# EAGLE design Module_MCU_ArduinoNano (EAGLE 9.6.2)
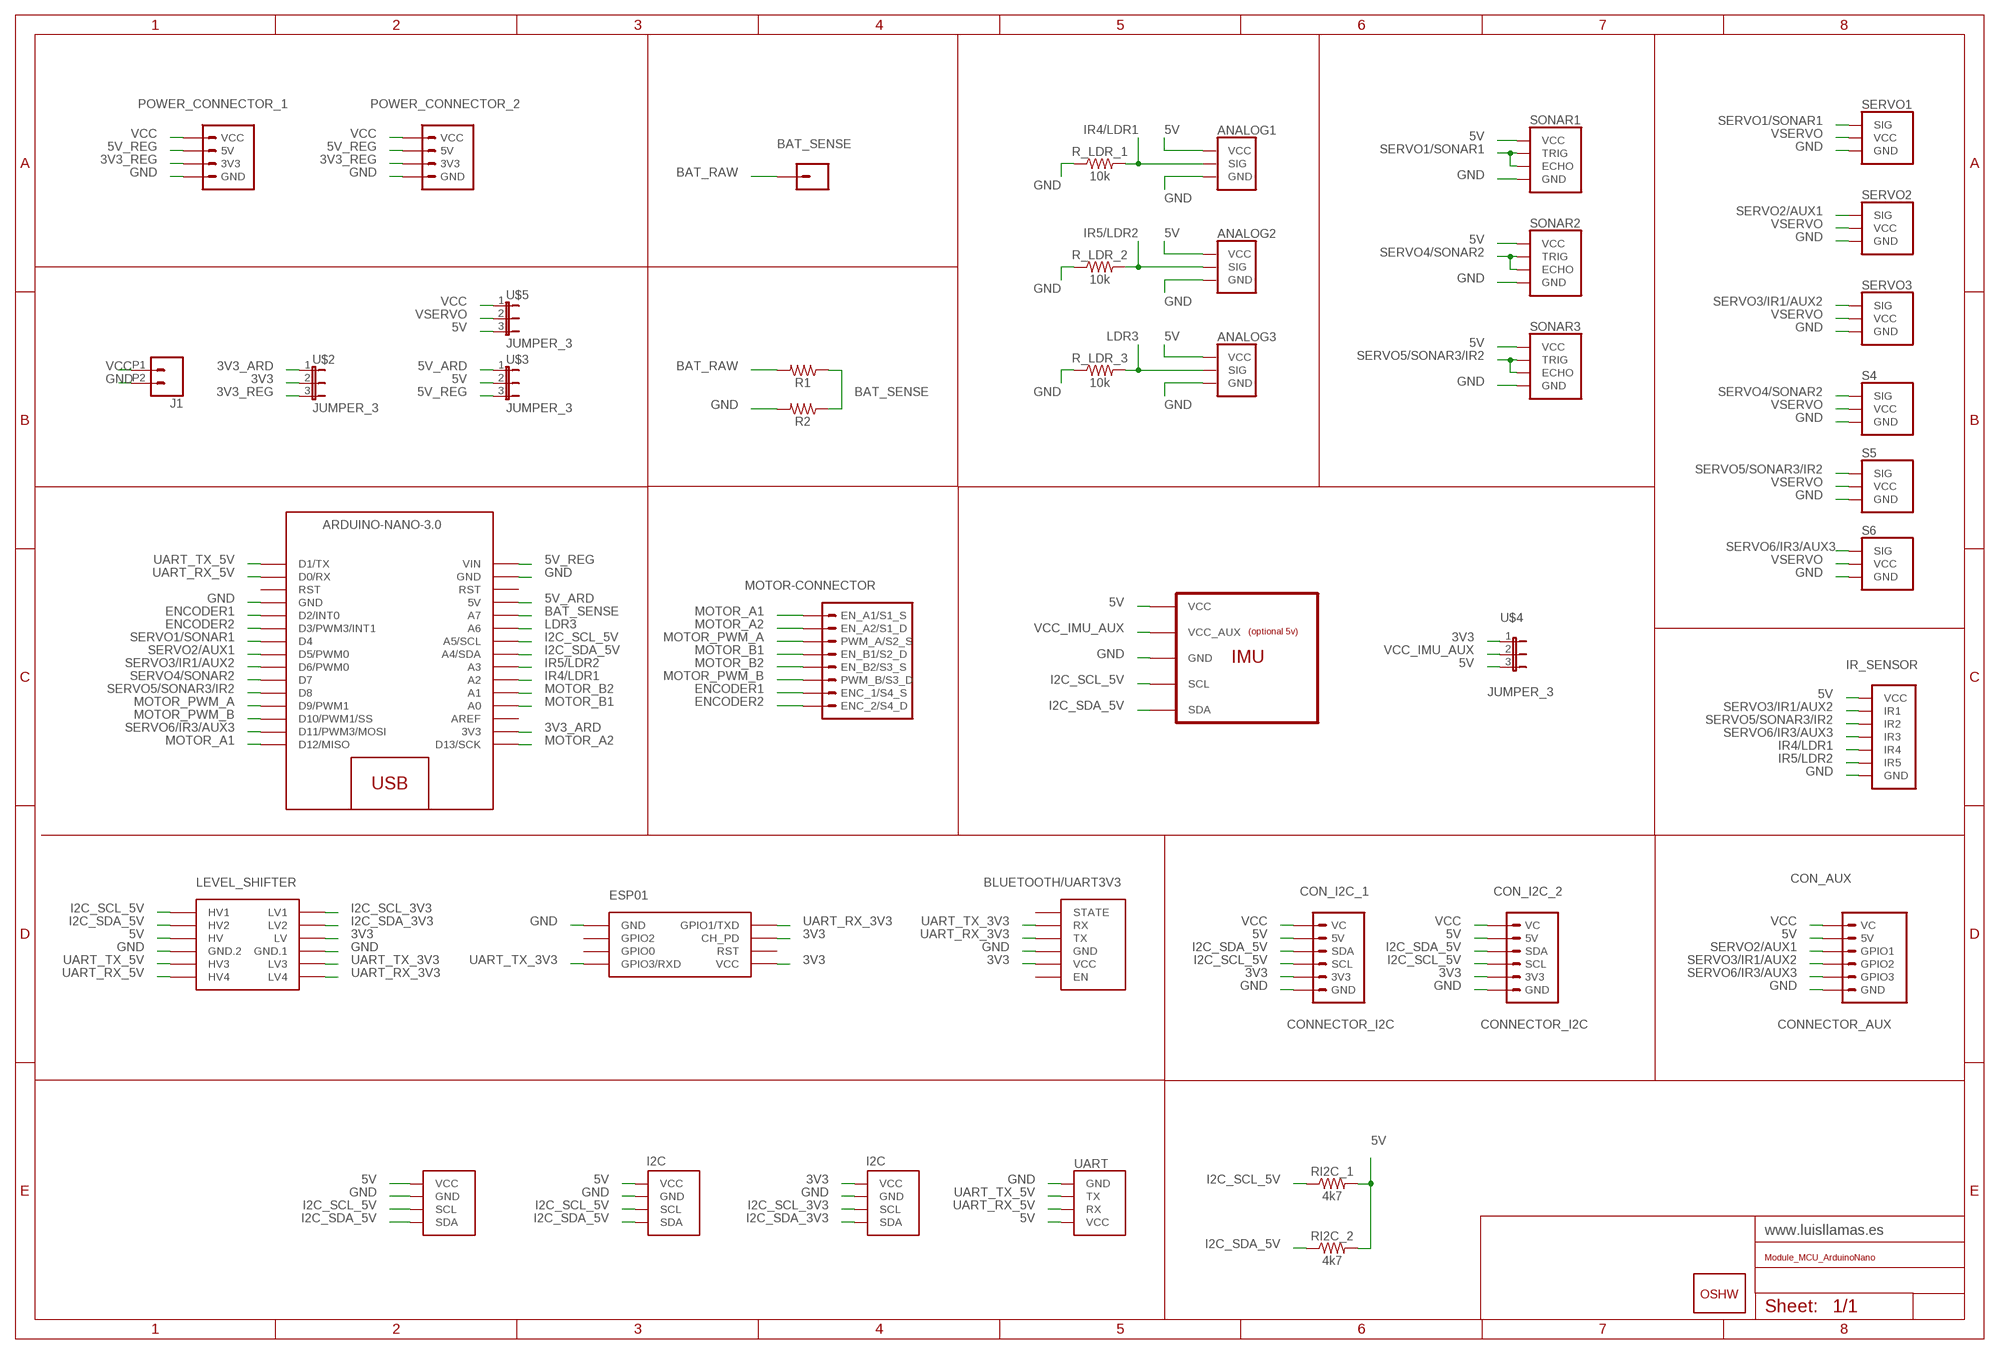
[diagram p0: schematic, sheet 1]

## Parts
ANALOG1  LDR/OCT  [LDR]
ANALOG2  LDR/OCT  [LDR]
ANALOG3  LDR/OCT  [LDR]
ARDUINO_NANO1  ARDUINO-NANO-3.0  [ARDUINO-NANO-3.0]
BAT_SENSE  CONN_01  [1X01]
BLUETOOTH/UART3V3  BLUETOOTH-HC-05  [BLUETOOTH-HC-05]
CON_AUX  CONNECTOR_AUX  [CONNECTOR_AUX]
CON_I2C_1  CONNECTOR_I2C  [CONNECTOR_I2C]
CON_I2C_2  CONNECTOR_I2C  [CONNECTOR_I2C]
GOLD_ORB_SM1  OSHWLOGO_GOLD_ORB_MED  [OSHW1]
I2C_1  I2C  GENERIC_I2CVCC_GND_SCL_SDA  [I2C_VCC_GND_SCL_SDA]
I2C_2  GENERIC_I2CVCC_GND_SCL_SDA  [I2C_VCC_GND_SCL_SDA]
I2C_3  I2C  GENERIC_I2CVCC_GND_SCL_SDA  [I2C_VCC_GND_SCL_SDA]
IR_SENSOR  IR-5/OCT  [IR-5]
J1  CONN_022.54MM_SCREWTERM  [1X02_2.54_SCREWTERM]
LEVEL_SHIFTER  LEVEL-SHIFTER-4CH  [LEVEL-SHIFTER-4CH]
MOTOR_CONNECTOR  MOTOR-CONNECTOR  [MOTOR-CONNECTOR]
POWER_CONNECTOR_1  POWER-CONNECTOR  [POWER-CONNECTOR]
POWER_CONNECTOR_2  POWER-CONNECTOR  [POWER-CONNECTOR]
R1  RESISTOR1206  [1206]
R2  RESISTOR1206  [1206]
R_LDR_1  10k  RESISTOR1206  [1206]
R_LDR_2  10k  RESISTOR1206  [1206]
R_LDR_3  10k  RESISTOR1206  [1206]
RI2C_1  4k7  RESISTOR1206  [1206]
RI2C_2  4k7  RESISTOR1206  [1206]
S4  SERVOSERVO  [SERVO]
S5  SERVOSERVO  [SERVO]
S6  SERVOSERVO  [SERVO]
SERVO1  SERVOSERVO  [SERVO]
SERVO2  SERVOSERVO  [SERVO]
SERVO3  SERVOSERVO  [SERVO]
SONAR1  ULTRASONIC/OCT  [ULTRASONIC]
SONAR2  ULTRASONIC/OCT  [ULTRASONIC]
SONAR3  ULTRASONIC/OCT  [ULTRASONIC]
U1  IMU_6/9/10DOFMPU6050  [IMU_6/9/10DOF]
U$1  ESP01  [ESP01]
U$2  JUMPER_3  [JUMPER_3]
U$3  JUMPER_3  [JUMPER_3]
U$4  JUMPER_3  [JUMPER_3]
U$5  JUMPER_3  [JUMPER_3]
UART  UART  GENERIC_UARTGND_TX_RX_VCC  [GENERIC_UART]

## Nets
3V3: BLUETOOTH/UART3V3.VCC CON_I2C_1.3V3 CON_I2C_2.3V3 I2C_3.VCC LEVEL_SHIFTER.J1.3(LV) U$1.CH_PD U$1.VCC U$2.2 U$4.1
3V3_ARD: ARDUINO_NANO1.3V3 U$2.1
3V3_REG: POWER_CONNECTOR_1.3V3 POWER_CONNECTOR_2.3V3 U$2.3
5V: ANALOG1.VCC ANALOG2.VCC ANALOG3.VCC CON_AUX.5V CON_I2C_1.5V CON_I2C_2.5V I2C_1.VCC I2C_2.VCC IR_SENSOR.VCC LEVEL_SHIFTER.J2.3(HV) RI2C_1.2 RI2C_2.2 SONAR1.VCC SONAR2.VCC SONAR3.VCC U1.VCC U$3.2 U$4.3 U$5.3 UART.VCC
5V_ARD: ARDUINO_NANO1.5V U$3.1
5V_REG: ARDUINO_NANO1.VIN POWER_CONNECTOR_1.5V POWER_CONNECTOR_2.5V U$3.3
BAT_RAW: BAT_SENSE.1 R1.2
BAT_SENSE: ARDUINO_NANO1.A7 R1.1 R2.1
ENCODER1: ARDUINO_NANO1.D2(D2/INT0) MOTOR_CONNECTOR.ENC_1/S4_S
ENCODER2: ARDUINO_NANO1.D3(D3/PWM3/INT1) MOTOR_CONNECTOR.ENC_2/S4_D
GND: ANALOG1.GND ANALOG2.GND ANALOG3.GND ARDUINO_NANO1.GND@1(GND) ARDUINO_NANO1.GND@2(GND) BLUETOOTH/UART3V3.GND CON_AUX.GND CON_I2C_1.GND CON_I2C_2.GND I2C_1.GND I2C_2.GND I2C_3.GND IR_SENSOR.GND J1.P2 LEVEL_SHIFTER.J1.4(GND.1) LEVEL_SHIFTER.J2.4(GND.2) POWER_CONNECTOR_1.GND POWER_CONNECTOR_2.GND R2.2 R_LDR_1.1 R_LDR_2.1 R_LDR_3.1 S4.GND S5.GND S6.GND SERVO1.GND SERVO2.GND SERVO3.GND SONAR1.GND SONAR2.GND SONAR3.GND U1.GND U$1.GND UART.GND
I2C_SCL_3V3: I2C_3.SCL LEVEL_SHIFTER.J1.1(LV1)
I2C_SCL_5V: ARDUINO_NANO1.A5(A5/SCL) CON_I2C_1.SCL CON_I2C_2.SCL I2C_1.SCL I2C_2.SCL LEVEL_SHIFTER.J2.1(HV1) RI2C_1.1 U1.SCL
I2C_SDA_3V3: I2C_3.SDA LEVEL_SHIFTER.J1.2(LV2)
I2C_SDA_5V: ARDUINO_NANO1.A4(A4/SDA) CON_I2C_1.SDA CON_I2C_2.SDA I2C_1.SDA I2C_2.SDA LEVEL_SHIFTER.J2.2(HV2) RI2C_2.1 U1.SDA
IR4/LDR1: ANALOG1.SIG ARDUINO_NANO1.A2 IR_SENSOR.4(IR4) R_LDR_1.2
IR5/LDR2: ANALOG2.SIG ARDUINO_NANO1.A3 IR_SENSOR.5(IR5) R_LDR_2.2
LDR3: ANALOG3.SIG ARDUINO_NANO1.A6 R_LDR_3.2
MOTOR_A1: ARDUINO_NANO1.D12(D12/MISO) MOTOR_CONNECTOR.EN_A1/S1_S
MOTOR_A2: ARDUINO_NANO1.D13(D13/SCK) MOTOR_CONNECTOR.EN_A2/S1_D
MOTOR_B1: ARDUINO_NANO1.A0 MOTOR_CONNECTOR.EN_B1/S2_D
MOTOR_B2: ARDUINO_NANO1.A1 MOTOR_CONNECTOR.EN_B2/S3_S
MOTOR_PWM_A: ARDUINO_NANO1.D9(D9/PWM1) MOTOR_CONNECTOR.PWM_A/S2_S
MOTOR_PWM_B: ARDUINO_NANO1.D10(D10/PWM1/SS) MOTOR_CONNECTOR.PWM_B/S3_D
SERVO1/SONAR1: ARDUINO_NANO1.D4 SERVO1.SIG SONAR1.ECHO SONAR1.TRIG
SERVO2/AUX1: ARDUINO_NANO1.D5(D5/PWM0) CON_AUX.GPIO1 SERVO2.SIG
SERVO3/IR1/AUX2: ARDUINO_NANO1.D6(D6/PWM0) CON_AUX.GPIO2 IR_SENSOR.1(IR1) SERVO3.SIG
SERVO4/SONAR2: ARDUINO_NANO1.D7 S4.SIG SONAR2.ECHO SONAR2.TRIG
SERVO5/SONAR3/IR2: ARDUINO_NANO1.D8 IR_SENSOR.2(IR2) S5.SIG SONAR3.ECHO SONAR3.TRIG
SERVO6/IR3/AUX3: ARDUINO_NANO1.D11(D11/PWM3/MOSI) CON_AUX.GPIO3 IR_SENSOR.3(IR3) S6.SIG
UART_RX_3V3: BLUETOOTH/UART3V3.TX LEVEL_SHIFTER.J1.6(LV4) U$1.TX(GPIO1/TXD)
UART_RX_5V: ARDUINO_NANO1.RX0(D0/RX) LEVEL_SHIFTER.J2.6(HV4) UART.RX
UART_TX_3V3: BLUETOOTH/UART3V3.RX LEVEL_SHIFTER.J1.5(LV3) U$1.RX(GPIO3/RXD)
UART_TX_5V: ARDUINO_NANO1.TX1(D1/TX) LEVEL_SHIFTER.J2.5(HV3) UART.TX
VCC: CON_AUX.VC CON_I2C_1.VC CON_I2C_2.VC J1.P1 POWER_CONNECTOR_1.VCC POWER_CONNECTOR_2.VCC U$5.1
VCC_IMU_AUX: U1.VCC_AUX U$4.2
VSERVO: S4.VCC S5.VCC S6.VCC SERVO1.VCC SERVO2.VCC SERVO3.VCC U$5.2
Unconnected: ARDUINO_NANO1.REG(AREF) ARDUINO_NANO1.RST@1(RST) ARDUINO_NANO1.RST@2(RST) BLUETOOTH/UART3V3.EN BLUETOOTH/UART3V3.STATE U$1.GPIO0 U$1.GPIO2 U$1.RST

## Library data of the parts
ANALOG1-ANALOG3 = LLL_Headers:LDR: Header for LDR
ARDUINO_NANO1 = LLL_Arduino:ARDUINO-NANO-3.0: Arduino Nano 3.0 and compatible devices
BAT_SENSE = SparkFun-Connectors:CONN_01: Single connection point. Often used as Generic Header-pin footprint for 0.1 inch spaced/style header connections On any of the 0.1 inch spaced packages, you can populate with these: Break Away Headers - Straight <https://www.sparkfun.com/products/116> (PRT-00116) Break Away Male Headers - Right Angle <https://www.sparkfun.com/products/553> (PRT-00553) Female Headers <https://www.sparkfun.com/products/115> (PRT-00115) Break Away Headers - Machine Pin <https://www.sparkfun.com/products/117> (PRT-00117) Break Away Female Headers - Swiss Machine Pin <https://www.sparkfun.com/products/743> (PRT-00743) This device is also useful as a general connection point to wire up your design to another part of your project. Our various solder wires solder well into these plated through hole pads. Hook-Up Wire - Assortment (Stranded, 22 AWG) <https://www.sparkfun.com/products/11375> (PRT-11375) Hook-Up Wire - Assortment (Solid Core, 22 AWG) <https://www.sparkfun.com/products/11367> (PRT-11367) View the entire wire category on our website here <https://www.sparkfun.com/categories/141> Special notes: SMTSO-256-ET is a "flush mount" nut for a 4-40 screw. We mostly use this on specialty testbeds; it is a nice way to connect hardware to your PCB at an adjustable hieght. Also note, the SNAP packages are for using a snappable style connector. We sell a baggie of snaps and they are also used on two LilyPad designs: Snap Assortment - 30 pack (male and female) <https://www.sparkfun.com/products/11347> (DEV-11347) LilyPad Arduino SimpleSnap <https://www.sparkfun.com/products/10941> (DEV-10941) LilyPad SimpleSnap Protoboard <https://www.sparkfun.com/products/10940> (DEV-10940)
BLUETOOTH/UART3V3 = LLL_Bluetooth:BLUETOOTH-HC-05: Bluetooth Transceiver Module based on HC-05 board Tutorial is available here: https://arduino-info.wikispaces.com/BlueTooth-HC05-HC06-Modules-How-To Click here to find device on ebay.com <http://www.ebay.com/sch/hc-05+module+rs232>
CON_AUX = LLL_Connectors:CONNECTOR_AUX
CON_I2C_1 CON_I2C_2 = LLL_Connectors:CONNECTOR_I2C
GOLD_ORB_SM1 = LLL_Frames:OSHWLOGO: These are Open-Source Hardware logos.
I2C_1-I2C_3 = LLL_Headers:GENERIC_I2C
IR_SENSOR = LLL_Headers:IR-5: Header for sensor 5xIR
J1 = LLL_Connectors:CONN_02: Multi connection point. Often used as Generic Header-pin footprint for 0.1 inch spaced/style header connections On any of the 0.1 inch spaced packages, you can populate with these: Break Away Headers - Straight <https://www.sparkfun.com/products/116> (PRT-00116) Break Away Male Headers - Right Angle <https://www.sparkfun.com/products/553> (PRT-00553) Female Headers <https://www.sparkfun.com/products/115> (PRT-00115) Break Away Headers - Machine Pin <https://www.sparkfun.com/products/117> (PRT-00117) Break Away Female Headers - Swiss Machine Pin <https://www.sparkfun.com/products/743> (PRT-00743) For SCREWTERMINALS and SPRING TERMINALS visit here: Screw Terimnals on SparkFun.com <https://www.sparkfun.com/search/results?term=Screw+Terminals> (5mm/3.5mm/2.54mm spacing) This device is also useful as a general connection point to wire up your design to another part of your project. Our various solder wires solder well into these plated through hole pads. Hook-Up Wire - Assortment (Stranded, 22 AWG) <https://www.sparkfun.com/products/11375> (PRT-11375) Hook-Up Wire - Assortment (Solid Core, 22 AWG) <https://www.sparkfun.com/products/11367> (PRT-11367) View the entire wire category on our website here <https://www.sparkfun.com/categories/141> Special notes: Molex polarized connector foot print use with: PRT-08233 with associated crimp pins and housings. 2.54_SCREWTERM for use with PRT-10571. 3.5mm Screw Terminal footprints for PRT-08084 5mm Screw Terminal footprints for use with PRT-08432
LEVEL_SHIFTER = LLL_Power:LEVEL-SHIFTER-4CH: 4-Channel Bi-Directional Logic Level Converter based on BSS128 transistors Click here to find device on ebay.com <http://www.ebay.com/sch/i2c+logic+converter+module>
MOTOR_CONNECTOR = LLL_Motors:MOTOR-CONNECTOR: MOTOR CONNECTOR 8p DC Motor EN_A1 EN_A2 PWM_A EN_B1 EN_B2 PWM_B ENC_1 ENC_2 Stepper STEP1_S STEP1_D STEP2_S STEP2_D STEP3_S STEP3_D STEP4_S STEP4_D
POWER_CONNECTOR_1 POWER_CONNECTOR_2 = LLL_Power:POWER-CONNECTOR: JST Connector
R1 R2 R_LDR_1-R_LDR_3 RI2C_1 RI2C_2 = SparkFun-Resistors:RESISTOR: Generic Resistor Package
S4-S6 SERVO1-SERVO3 = LLL_Headers:SERVO: Header for servo
SONAR1-SONAR3 = LLL_Headers:ULTRASONIC: Header for ultrasonic sensor
U1 = LLL_IMUs:IMU_6/9/10DOF
U$1 = LLL_ESP8266:ESP01: ESP8266 Wifi module 01
U$2-U$5 = LLL_Jumpers:JUMPER_3
UART = LLL_Headers:GENERIC_UART

## Net classes
0 default: clearance 0.205 mm

## Board
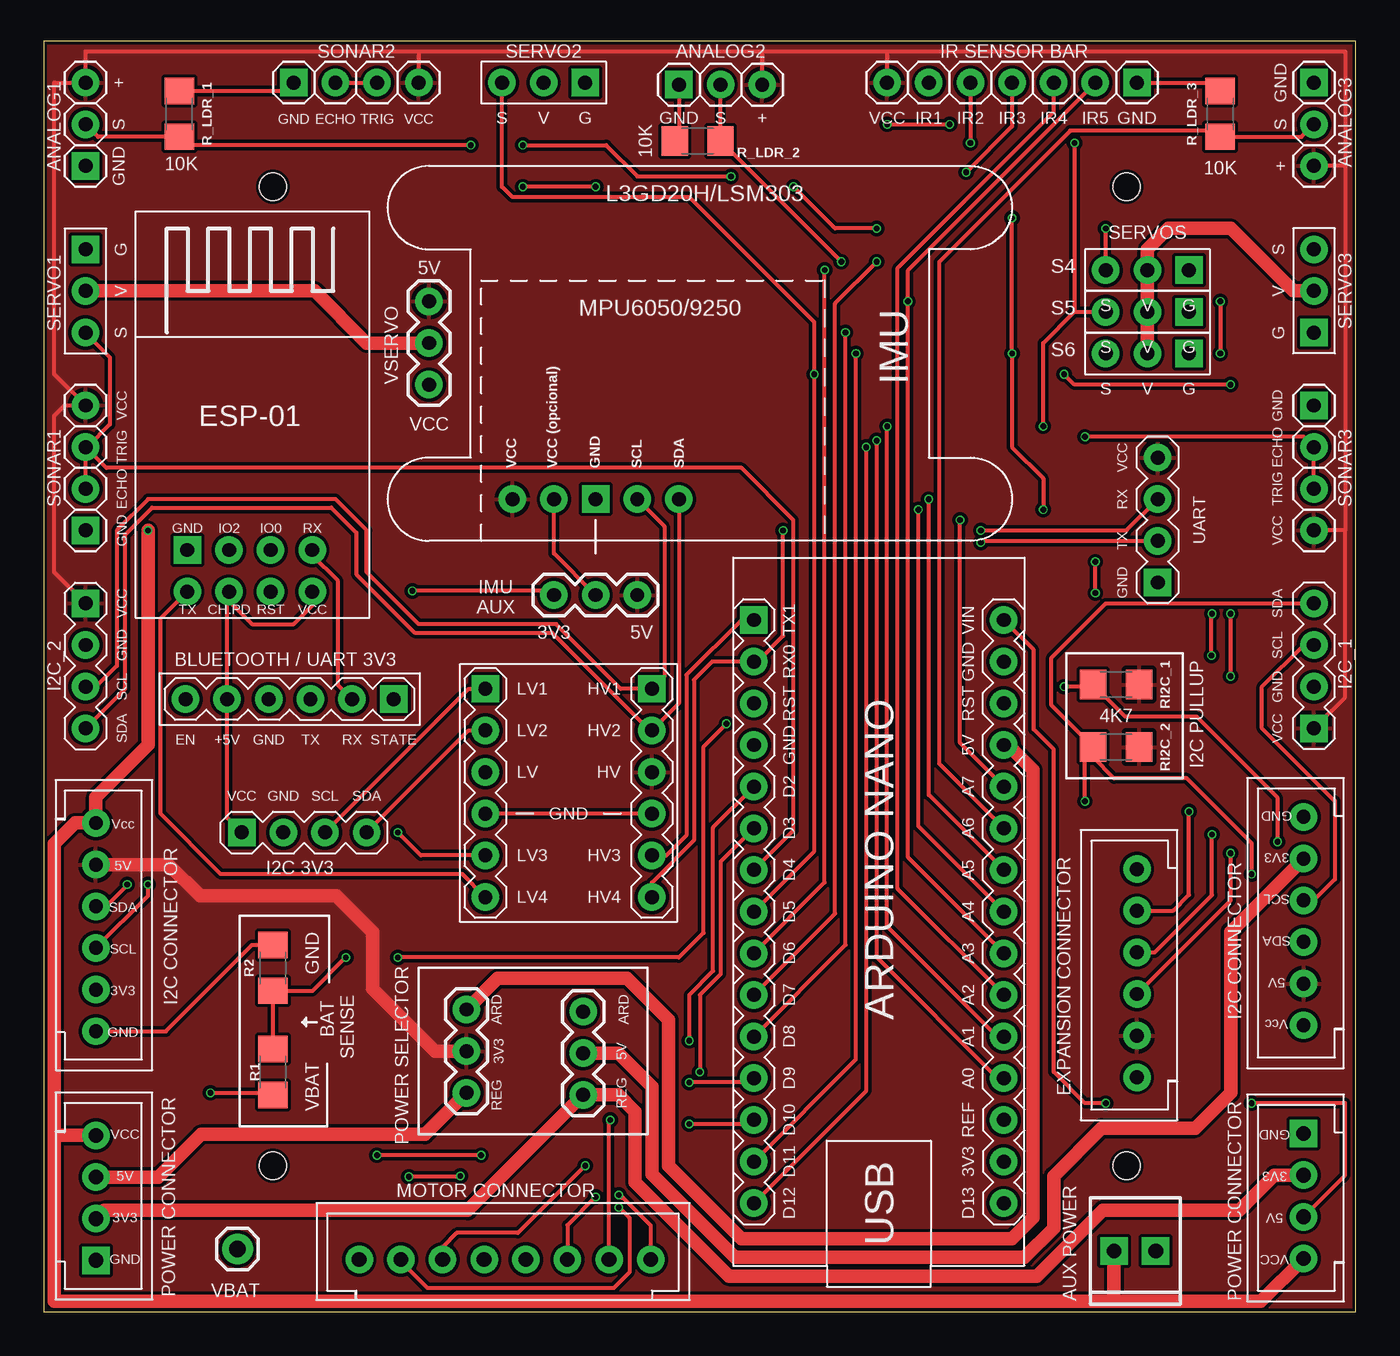
[diagram p1: board, top side]
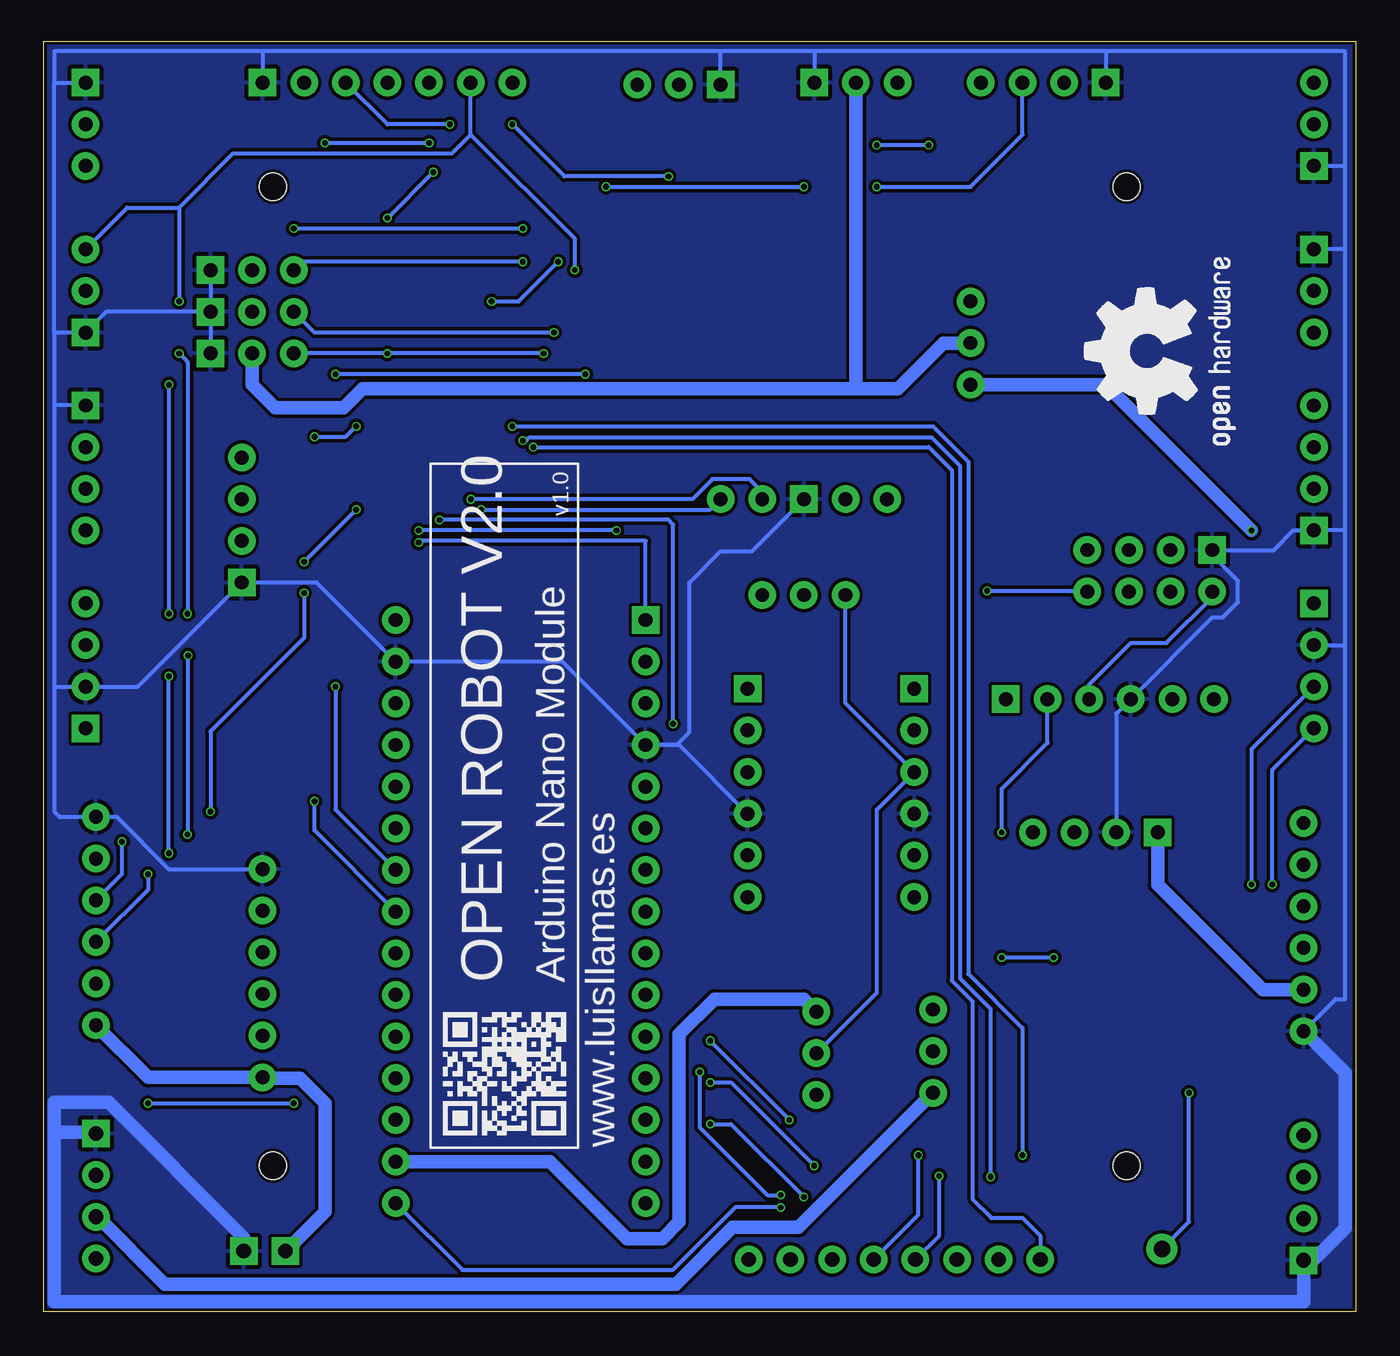
[diagram p2: board, bottom side, seen from below]

Size 80.01 x 77.47 mm. Coordinates in mm from the lower left corner, seen from the top.
Outline: 0,77.47 0,0 80.01,0 80.01,77.47 0,77.47
Copper layers (1*16): Top 0.035559375mm / dielectric 1.6mm / Bottom 0.035559375mm
Design rules "jlcpcb2layer": minimum track width 5mil, minimum drill 12mil, track to track 5mil, track to pad 5mil, pad to pad 5mil, via to via 5mil, smd to smd 5mil, copper to edge 8mil, drill to drill 6mil, minimum pad ring 5mil, minimum via ring 3mil, stop-mask expansion 2.5mil, vias tented up to drill 0mil, thermal gap 10mil
Holes 1.65 mm at 13.97,68.58 13.97,8.89 66.04,68.58 66.04,8.89

### Footprints (pad centres in the part's own frame; a part is rotated, then mirrored left to right if it is on the bottom)
LDR = drill 0.85 pad 1.676 square: GND 0,0 | drill 0.85 pad 1.676: SIG 2.54,0; VCC 5.08,0
ARDUINO-NANO-3.0 = drill 0.85 pad 1.676: 3V3 -15.24,-7.62; 5V 10.16,-7.62; A0 -10.16,-7.62; A1 -7.62,-7.62; A2 -5.08,-7.62; A3 -2.54,-7.62; A4 0,-7.62; A5 2.54,-7.62; A6 5.08,-7.62; A7 7.62,-7.62; D2 7.62,7.62; D3 5.08,7.62; D4 2.54,7.62; D5 0,7.62; D6 -2.54,7.62; D7 -5.08,7.62; D8 -7.62,7.62; D9 -10.16,7.62; D10 -12.7,7.62; D11 -15.24,7.62; D12 -17.78,7.62; D13 -17.78,-7.62; GND@1 10.16,7.62; GND@2 15.24,-7.62; REG -12.7,-7.62; RST@1 12.7,7.62; RST@2 12.7,-7.62; RX0 15.24,7.62; VIN 17.78,-7.62 | drill 0.85 pad 1.676 square: TX1 17.78,7.62
1X01 = drill 1.016 pad 1.88: 1 0,0
BLUETOOTH-HC-05 = drill 0.85 pad 1.676: EN 0.127,-12.7; GND 0.127,-7.62; RX 0.127,-2.54; TX 0.127,-5.08; VCC 0.127,-10.16 | drill 0.85 pad 1.676 square: STATE 0.127,0
CONNECTOR_AUX = drill 0.85 pad 1.676: 5V 0,-3.754; GND 0,6.406; GPIO1 0,-1.214; GPIO2 0,1.326; GPIO3 0,3.866; VC 0,-6.294
CONNECTOR_I2C = drill 0.85 pad 1.676: 3V3 0,3.866; 5V 0,-3.754; GND 0,6.406; SCL 0,1.326; SDA 0,-1.214; VC 0,-6.294
I2C_VCC_GND_SCL_SDA = drill 0.85 pad 1.676: GND 2.54,0; SCL 5.08,0; SDA 7.62,0 | drill 0.85 pad 1.676 square: VCC 0,0
IR-5 = drill 0.85 pad 1.676: 1 -5.08,0; 2 -2.54,0; 3 0,0; 4 2.54,0; 5 5.08,0; VCC -7.62,0 | drill 0.85 pad 1.676 square: GND 7.62,0
1X02_2.54_SCREWTERM = drill 0.9 pad 1.676 square: P1 2.54,0; P2 0,0
LEVEL-SHIFTER-4CH = drill 0.85 pad 1.676 square: J1.1 -5.08,6.35; J2.1 5.08,6.35 | drill 0.85 pad 1.676: J1.2 -5.08,3.81; J1.3 -5.08,1.27; J1.4 -5.08,-1.27; J1.5 -5.08,-3.81; J1.6 -5.08,-6.35; J2.2 5.08,3.81; J2.3 5.08,1.27; J2.4 5.08,-1.27; J2.5 5.08,-3.81; J2.6 5.08,-6.35
MOTOR-CONNECTOR = drill 0.9 pad 1.676: EN_A1/S1_S 0,-8.834; EN_A2/S1_D 0,-6.294; EN_B1/S2_D 0,-1.214; EN_B2/S3_S 0,1.326; ENC_1/S4_S 0,6.406; ENC_2/S4_D 0,8.946; PWM_A/S2_S 0,-3.754; PWM_B/S3_D 0,3.866
POWER-CONNECTOR = drill 0.9 pad 1.676: 3V3 0,1.326; 5V 0,-1.214; VCC 0,-3.754 | drill 0.9 pad 1.676 square: GND 0,3.866
1206 = smd 1.6 x 1.8: 1 -1.4,0; 2 1.4,0
SERVO = drill 0.85 pad 1.676 square: GND -2.54,0 | drill 0.85 pad 1.676: SIG 2.54,0; VCC 0,0
ULTRASONIC = drill 0.85 pad 1.676: ECHO 1.27,0; TRIG -1.27,0; VCC -3.81,0 | drill 0.85 pad 1.676 square: GND 3.81,0
IMU_6/9/10DOF = drill 0.85 pad 1.676 square: GND -8.89,6.35 | drill 0.85 pad 1.676: SCL -8.89,3.81; SDA -8.89,1.27; VCC -8.89,11.43; VCC_AUX -8.89,8.89
ESP01 = drill 0.85 pad 1.676: CH_PD -1.285,-8.178; GPIO0 1.255,-5.638; GPIO2 -1.285,-5.638; RST 1.255,-8.178; RX 3.795,-5.638; TX -3.825,-8.178; VCC 3.795,-8.178 | drill 0.85 pad 1.676 square: GND -3.825,-5.638
JUMPER_3 = drill 0.85 pad 1.676: 1 0,0; 2 2.54,0; 3 5.08,0
GENERIC_UART = drill 0.85 pad 1.676 square: GND 0,0 | drill 0.85 pad 1.676: RX 5.08,0; TX 2.54,0; VCC 7.62,0

### Placement (x,y rotation side)
ANALOG1  2.54,69.85 90 top
ANALOG2  38.73,74.8 0 top
ANALOG3  77.47,74.93 270 top
ARDUINO_NANO1  50.93,24.38 90 top
BAT_SENSE  11.81,3.81 0 top
BLUETOOTH/UART3V3  21.34,37.47 270 top
CON_AUX  66.67,20.57 0 top
CON_I2C_1  76.83,23.75 0 top
CON_I2C_2  3.17,23.5 180 top
GOLD_ORB_SM1  5.59,52.2 90 bottom
I2C_1  77.47,35.56 90 top
I2C_2  2.54,43.18 270 top
I2C_3  12.06,29.21 0 top
IR_SENSOR  59.05,74.93 0 top
J1  67.82,3.68 180 top
LEVEL_SHIFTER  32,31.62 0 top
MOTOR_CONNECTOR  28.07,3.17 270 top
POWER_CONNECTOR_1  3.17,6.99 180 top
POWER_CONNECTOR_2  76.83,6.99 0 top
R1  13.97,14.61 270 top
R2  13.97,20.95 90 top
R_LDR_1  8.26,73.03 270 top
R_LDR_2  39.88,71.37 0 top
R_LDR_3  71.75,73.03 270 top
RI2C_1  65.41,38.23 0 top
RI2C_2  65.41,34.42 0 top
S4  67.31,63.5 180 top
S5  67.31,60.96 180 top
S6  67.31,58.42 180 top
SERVO1  2.54,62.23 270 top
SERVO2  30.48,74.93 180 top
SERVO3  77.47,62.23 90 top
SONAR1  2.54,51.44 270 top
SONAR2  19.05,74.93 180 top
SONAR3  77.47,51.44 90 top
U1  40.01,58.42 90 top
U$1  12.57,52.07 0 top
U$2  32.89,18.29 270 top
U$3  25.78,18.41 270 top
U$4  31.11,43.69 0 top
U$5  23.5,56.52 90 top
UART  67.94,44.45 90 top

### Tracks (layer width: path | path; a pad name or v marks a point on that pad's centre or on a via)
3V3  (via drill 0.35)
  Top 0.254: I2C_3.VCC 11.18,30.1 BLUETOOTH/UART3V3.VCC 11.18,43.78 U$1.CH_PD 11.29,43.32 12.7,41.91 15.24,41.91 16.37,43.04 U$1.VCC | v22.48,43.94 30.86,43.94 U$4.1
  Top 0.813: U$2.2 35.05,15.75 37.08,13.72 37.08,8.38 42.16,3.3 59.82,3.3 61.59,5.08 61.59,8.26 64.52,11.18 70.23,11.18 72.39,13.34 72.39,23.17 CON_I2C_1.3V3
  Bottom 0.254: U$4.1 31.11,37.08 LEVEL_SHIFTER.J1.3 29.21,30.61 29.21,19.43 U$2.2 | U$1.VCC 16.42,43.94 v22.48,43.94
  Bottom 0.813: I2C_3.VCC 12.06,26.04 5.66,19.63 CON_I2C_2.3V3
3V3_ARD
  Bottom 0.813: ARDUINO_NANO1.3V3 49.15,9.14 44.45,4.45 42.29,4.45 41.27,5.46 41.27,16.89 39.12,19.05 33.66,19.05 U$2.1
3V3_REG
  Top 0.813: POWER_CONNECTOR_1.3V3 3.68,6.17 25.85,6.17 U$2.3 35.05,13.21 36.06,12.2 36.06,7.88 41.78,2.16 60.58,2.16 64.61,6.18 72.93,6.18 75.06,8.31 POWER_CONNECTOR_2.3V3
5V
  Top 0.254: I2C_2.VCC 0.64,45.09 0.64,54.61 1.27,55.24 SONAR1.VCC 0.64,57.15 0.64,74.93 ANALOG1.VCC 2.54,76.83 22.86,76.83 | 22.86,76.83 SONAR2.VCC | 22.86,76.83 43.81,76.83 | 43.81,76.83 ANALOG2.VCC | 43.81,76.83 51.44,76.83 | 51.44,76.83 IR_SENSOR.VCC | 51.44,76.83 79.38,76.83 79.38,69.85 | 79.38,69.85 ANALOG3.VCC | 79.38,69.85 79.38,47.62 | 79.38,47.62 SONAR3.VCC | I2C_1.VCC 79.38,37.47 79.38,47.62
  Top 0.813: U$3.2 23.88,15.88 20.07,19.68 20.07,23.11 17.84,25.34 9.53,25.34 7.62,27.25 CON_I2C_2.5V
  pour Top (rank 2): 0,0 0,77.47 80.01,77.47 80.01,0
5V_ARD
  Top 0.813: U$3.1 27.69,20.32 35.56,20.32 38.1,17.78 38.1,8.89 42.55,4.45 59.05,4.45 60.33,5.71 60.33,33.02 58.8,34.54 ARDUINO_NANO1.5V
5V_REG  (via drill 0.35)
  Top 0.254: POWER_CONNECTOR_2.5V 79.38,8.31 79.38,12.7 v73.66,12.7 | ARDUINO_NANO1.VIN 60.37,40.34 60.37,35.49 61.59,34.27 61.59,14.61 63.5,12.7 v64.77,12.7
  Top 0.813: U$3.3 23.24,10.79 9.58,10.79 6.99,8.2 POWER_CONNECTOR_1.5V
  Bottom 0.254: v73.66,12.7 v64.77,12.7
  Bottom 0.813: U$3.3 33.98,5.14 38,5.14 41.46,1.68 72.64,1.68 76.74,5.77 POWER_CONNECTOR_2.5V
BAT_RAW  (via drill 0.35)
  Top 0.254: v10.16,13.34 13.84,13.34 R1.2
  Bottom 0.254: BAT_SENSE.1 10.16,5.46 v10.16,13.34
BAT_SENSE  (via drill 0.35)
  Top 0.254: ARDUINO_NANO1.A7 55.88,34.67 v55.88,48.26 | R1.1 R2.1 16.38,19.55 v18.41,21.59 | v41.63,35.84 40.23,34.44 40.23,23.09 38.73,21.59 v21.59,21.59
  Bottom 0.254: v21.59,21.59 v18.41,21.59 | v41.63,35.84 41.63,47.98 41.95,48.3 55.84,48.3 v55.88,48.26
ENCODER1  (via drill 0.35)
  Top 0.254: MOTOR_CONNECTOR.ENC_1/S4_S 34.47,11.61 v34.54,11.68 | ARDUINO_NANO1.D2 40.82,29.52 40.82,20.77 39.37,19.31 v39.37,16.51
  Bottom 0.254: v39.37,16.51 v34.54,11.68
ENCODER2  (via drill 0.35)
  Top 0.254: ARDUINO_NANO1.D3 41.28,27.44 41.28,20.57 40.01,19.3 v40.01,14.61 | v35.07,7.1 35.23,6.94 35.31,6.94 37.01,5.25 MOTOR_CONNECTOR.ENC_2/S4_D
  Bottom 0.254: v40.01,14.61 40.01,11.22 35.88,7.1 v35.07,7.1
GND
  Top 0.254: CON_I2C_2.GND 7.43,17.09 12.7,22.36 R2.2 | LEVEL_SHIFTER.J2.4 LEVEL_SHIFTER.J1.4 | IR_SENSOR.GND 71.25,74.93 R_LDR_3.1 | R_LDR_1.1 14.73,74.42 SONAR2.GND | ANALOG2.GND 38.73,71.63 R_LDR_2.1
  Bottom 0.254: I2C_3.GND 14.61,36.45 BLUETOOTH/UART3V3.GND 8.74,42.32 8.1,42.32 7.17,43.24 7.17,44.55 8.75,46.12 U$1.GND 5,46.43 3.81,47.62 SONAR1.GND 0.64,47.62 | I2C_2.GND 0.64,40.64 | 0.64,40.64 0.64,47.62 | 0.64,47.62 0.64,64.77 | 0.64,64.77 SERVO1.GND | 0.64,64.77 0.64,69.85 | ANALOG1.GND 0.64,69.85 | 0.64,69.85 0.64,76.83 15.24,76.83 | 15.24,76.83 SONAR2.GND | 15.24,76.83 33.02,76.83 | 33.02,76.83 SERVO2.GND | 33.02,76.83 38.73,76.83 | ANALOG2.GND 38.73,76.83 | 38.73,76.83 66.67,76.83 | 66.67,76.83 IR_SENSOR.GND | 66.67,76.83 79.38,76.83 79.38,74.93 | 79.38,74.93 ANALOG3.GND | 79.38,59.69 SERVO3.GND 76.2,60.96 S5.GND | 79.38,59.69 79.38,74.93 | 79.38,59.69 79.38,55.24 | SONAR3.GND 79.38,55.24 | 79.38,55.24 79.38,38.1 | 79.38,38.1 I2C_1.GND 74.3,38.1 UART.GND 63.37,44.45 ARDUINO_NANO1.GND@2 48.39,39.62 ARDUINO_NANO1.GND@1 | 79.38,38.1 79.38,30.48 79.05,30.16 CON_I2C_1.GND 75.56,30.16 72.39,26.98 CON_AUX.GND | LEVEL_SHIFTER.J2.4 41.27,34.54 ARDUINO_NANO1.GND@1 | S4.GND S5.GND | S5.GND S6.GND | ARDUINO_NANO1.GND@1 41.4,34.54 40.64,35.31 40.64,44.45 38.73,46.35 36.83,46.35 U1.GND | CON_I2C_2.GND 1.21,19.05 0.64,19.05 0.64,40.64
  Bottom 0.813: CON_I2C_2.GND 0.64,14.55 0.64,5.08 2.6,3.12 POWER_CONNECTOR_1.GND 3.17,0.61 79.38,0.61 79.38,10.92 | 79.38,10.92 79.38,12.75 76.05,12.75 67.82,4.51 J1.P2 | 79.38,10.92 76.91,10.92 POWER_CONNECTOR_2.GND
  pour Bottom (rank 2): 0,0 0,77.47 80.01,77.47 80.01,0
I2C_SCL_3V3
  Top 0.254: I2C_3.SCL 25.91,37.97 LEVEL_SHIFTER.J1.1
I2C_SCL_5V  (via drill 0.35)
  Top 0.254: ARDUINO_NANO1.A5 53.98,31.5 v53.98,49.53 | v75.25,28.64 75.25,31.31 70.28,36.28 65.95,36.28 RI2C_1.1 63.88,38.1 v62.23,38.1 | U1.SCL 37.85,47.88 37.85,38.74 LEVEL_SHIFTER.J2.1 35.18,37.97 31.24,41.91 22.86,41.91 19.68,45.09 19.68,47.62 17.78,49.53 6.35,49.53 4.45,47.62 4.45,39.37 3.17,38.1 I2C_2.SCL | I2C_1.SCL 76.83,40.64 74.3,38.1 74.3,35.56 78.74,31.11 78.74,26.34 77.47,25.07 CON_I2C_1.SCL | CON_I2C_2.SCL 6.35,25.34 v6.35,26.04
  Bottom 0.254: v62.23,38.1 62.23,30.61 ARDUINO_NANO1.A5 | v53.98,49.53 40.46,49.53 39.24,50.75 36.96,50.75 36.2,49.99 U1.SCL | I2C_2.SCL 6.35,34.29 v6.35,26.04 | v75.25,28.64 75.25,26.66 76.83,25.08 CON_I2C_1.SCL
I2C_SDA_3V3
  Top 0.254: I2C_3.SDA 25.91,35.43 LEVEL_SHIFTER.J1.2
I2C_SDA_5V  (via drill 0.35)
  Top 0.254: ARDUINO_NANO1.A4 53.34,29.59 v53.34,48.9 | RI2C_2.1 64,33.78 65.28,32.51 69.72,32.51 73.66,28.57 v73.66,26.67 | v63.5,31.11 63.5,33.91 RI2C_2.1 | U1.SDA 38.73,37.08 37.34,35.69 | 37.34,35.69 LEVEL_SHIFTER.J2.2 | I2C_2.SDA 4.95,37.97 4.95,47.37 6.6,49.02 17.53,49.02 19.05,47.5 19.05,44.96 22.61,41.4 30.99,41.4 36.7,35.69 37.34,35.69 | RI2C_2.1 61.47,36.95 61.47,39.88 64.77,43.18 I2C_1.SDA | v5.08,26.04 5.08,25.98 3.81,24.71 CON_I2C_2.SDA
  Bottom 0.254: ARDUINO_NANO1.A4 63.5,29.34 v63.5,31.11 | v53.34,48.9 39.37,48.9 U1.SDA | I2C_2.SDA 5.08,33.02 v5.08,26.04 | v73.66,26.67 73.66,25.71 CON_I2C_1.SDA
IR4/LDR1  (via drill 0.35)
  Top 0.254: ARDUINO_NANO1.A2 52.07,25.78 52.07,63.63 61.59,73.15 IR_SENSOR.4 | ANALOG1.SIG 3.3,71.63 R_LDR_1.2 8.76,71.12 v26.03,71.12 v26.04,71.12 | v29.21,71.12 34.29,71.12 36.2,69.22 v41.91,69.22 | v51.44,72.39 v55.24,72.39
  Bottom 0.254: v26.04,71.12 v29.21,71.12 | v41.91,69.22 48.26,69.22 v51.44,72.39 | v55.24,72.39 59.05,72.39 IR_SENSOR.4
IR5/LDR2  (via drill 0.35)
  Top 0.254: ARDUINO_NANO1.A3 52.7,27.69 v52.7,61.59 52.7,63.5 IR_SENSOR.5 | v48.64,64.01 R_LDR_2.2 ANALOG2.SIG
  Bottom 0.254: v52.7,61.59 51.05,61.59 v48.64,64.01
LDR3
  Top 0.254: ARDUINO_NANO1.A6 54.61,33.4 54.61,64.01 62.61,72.01 71.37,72.01 R_LDR_3.2 76.7,71.62 ANALOG3.SIG
MOTOR_A1  (via drill 0.35)
  Top 0.254: ARDUINO_NANO1.D12 50.16,13.46 v50.16,52.7
  Bottom 0.254: v50.16,52.7 26.04,52.7 24.64,51.31 24.64,20.18 23.37,18.91 23.37,6.86 22.23,5.71 20.32,5.71 19.23,4.63 MOTOR_CONNECTOR.EN_A1/S1_S
MOTOR_A2  (via drill 0.35)
  Top 0.254: MOTOR_CONNECTOR.EN_A2/S1_D 21.77,3.06 23.4,1.43 34.75,1.43 35.71,2.39 35.71,5.71 v35.07,6.35
  Bottom 0.254: ARDUINO_NANO1.D13 54.48,2.54 41.64,2.54 37.8,6.38 35.1,6.38 v35.07,6.35
MOTOR_B1  (via drill 0.35)
  Top 0.254: ARDUINO_NANO1.A0 58.17,14.22 50.8,21.59 v50.8,53.1 | v25.4,8.26 25.36,8.22 v22.27,8.22
  Bottom 0.254: v50.8,53.1 50.61,53.1 50.41,53.3 25.87,53.3 24.13,51.56 24.13,20.32 22.27,18.46 v22.27,8.22 | MOTOR_CONNECTOR.EN_B1/S2_D 25.4,4.63 v25.4,8.26
MOTOR_B2  (via drill 0.35)
  Top 0.254: ARDUINO_NANO1.A1 58.36,16.57 51.44,23.5 v51.44,53.98 | v26.67,9.53 v20.32,9.53
  Bottom 0.254: v51.44,53.98 25.78,53.98 23.62,51.82 23.62,20.59 20.32,17.29 v20.32,9.53 | MOTOR_CONNECTOR.EN_B2/S3_S 26.67,5.9 v26.67,9.53
MOTOR_PWM_A  (via drill 0.35)
  Top 0.254: ARDUINO_NANO1.D9 43.05,13.97 v39.37,13.97 | v33.02,8.89 28.92,4.79 25.18,4.79 24.31,3.93 MOTOR_CONNECTOR.PWM_A/S2_S
  Bottom 0.254: v39.37,13.97 38.1,13.97 v33.02,8.89
MOTOR_PWM_B  (via drill 0.35)
  Top 0.254: ARDUINO_NANO1.D10 43.05,11.43 v39.37,11.43 | v33.66,6.99 31.93,5.26 MOTOR_CONNECTOR.PWM_B/S3_D
  Bottom 0.254: v39.37,11.43 38.1,11.43 v33.66,6.99
SERVO1/SONAR1
  Top 0.254: ARDUINO_NANO1.D4 45.72,29.34 45.72,48.26 42.55,51.44 3.81,51.44 SONAR1.TRIG | SONAR1.ECHO SONAR1.TRIG | SERVO1.SIG 2.54,59.65 4.01,58.18 4.01,54.09 2.63,52.7 SONAR1.TRIG
SERVO2/AUX1  (via drill 0.35)
  Top 0.254: ARDUINO_NANO1.D5 46.99,28.07 v46.99,57.15 46.99,60.33 39.37,67.94 28.57,67.94 27.94,68.58 SERVO2.SIG | CON_AUX.GPIO1 72.39,25.07 v72.39,27.94 | v72.39,38.73 v72.39,42.55 | v72.39,56.52 62.87,56.52 v62.23,57.15
  Bottom 0.254: v72.39,27.94 v72.39,38.73 | v46.99,57.15 v62.23,57.15 | v72.39,56.52 v72.39,42.55
SERVO3/IR1/AUX2  (via drill 0.35)
  Top 0.254: ARDUINO_NANO1.D6 47.62,26.16 v47.62,63.5 | CON_AUX.GPIO2 67.76,21.9 71.25,25.39 v71.25,29.08 | v71.22,40.01 71.22,42.51 v71.25,42.55 | v71.75,61.59 v71.75,58.42
  Bottom 0.254: 53.98,71.75 47.62,65.41 v47.62,63.5 | 53.98,71.75 IR_SENSOR.1 | SERVO3.SIG 74.93,67.31 71.75,67.31 | 71.75,67.31 68.45,70.61 55.12,70.61 53.98,71.75 | v71.22,40.01 71.25,39.97 v71.25,29.08 | v71.25,42.55 71.25,57.91 v71.75,58.42 | 71.75,67.31 v71.75,61.59
SERVO4/SONAR2  (via drill 0.35)
  Top 0.254: ARDUINO_NANO1.D7 48.26,24.26 48.26,61.47 v50.8,64.01 | SONAR2.ECHO SONAR2.TRIG | S4.SIG v64.77,66.04 | v50.8,66.04 48.26,66.04 v45.72,68.58 | v33.66,68.58 v29.21,68.58
  Bottom 0.254: v50.8,64.01 64.26,64.01 S4.SIG | v64.77,66.04 v50.8,66.04 | v45.72,68.58 v33.66,68.58 | v29.21,68.58 23.5,68.58 20.32,71.75 SONAR2.TRIG
SERVO5/SONAR3/IR2  (via drill 0.35)
  Top 0.254: ARDUINO_NANO1.D8 48.9,22.35 v48.9,59.69 | SONAR3.TRIG SONAR3.ECHO 76.83,53.34 v63.5,53.34 | v60.96,53.98 60.96,59.05 62.87,60.96 | 62.87,60.96 S5.SIG | IR_SENSOR.2 v56.52,71.25 | v62.87,71.25 62.87,60.96
  Bottom 0.254: v48.9,59.69 63.5,59.69 S5.SIG | v63.5,53.34 61.59,53.34 v60.96,53.98 | v56.52,71.25 v62.87,71.25
SERVO6/IR3/AUX3  (via drill 0.35)
  Top 0.254: ARDUINO_NANO1.D11 49.53,15.37 v49.53,58.42 | v59.05,66.67 v59.05,58.42 59.05,52.7 60.96,50.8 v60.96,48.9 | IR_SENSOR.3 59.05,72.26 v56.26,69.47 | CON_AUX.GPIO3 68.89,24.44 69.85,25.4 v69.85,30.48 | v64.14,43.81 v64.14,45.72
  Bottom 0.254: S6.SIG v59.05,58.42 v49.53,58.42 | v59.05,66.67 v56.26,69.47 | v64.14,43.81 64.14,41.08 69.85,35.37 v69.85,30.48 | v60.96,48.9 v64.14,45.72
UART_RX_3V3
  Top 0.254: LEVEL_SHIFTER.J1.6 25.53,26.67 10.79,26.67 7.1,30.37 7.1,42.24 U$1.TX
  Bottom 0.254: BLUETOOTH/UART3V3.TX 16.26,38.23 13.72,40.77 11.54,40.77 8.75,43.56 U$1.TX
UART_RX_5V  (via drill 0.35)
  Top 0.254: LEVEL_SHIFTER.J2.6 37.08,26.16 39.65,28.73 39.65,38.51 40.77,39.62 ARDUINO_NANO1.RX0 43.52,39.62 45.09,41.19 v45.09,47.62 | v57.15,47.62 66.04,47.62 UART.RX
  Bottom 0.254: v45.09,47.62 v57.15,47.62
UART_TX_3V3  (via drill 0.35)
  Top 0.254: U$1.RX 16.37,46.12 17.94,44.55 17.94,38.19 BLUETOOTH/UART3V3.RX | LEVEL_SHIFTER.J1.5 22.99,27.81 v21.59,29.21
  Bottom 0.254: v21.59,29.21 21.59,31.88 18.8,34.67 BLUETOOTH/UART3V3.RX
UART_TX_5V  (via drill 0.35)
  Top 0.254: ARDUINO_NANO1.TX1 42.55,42.16 39.19,38.81 39.19,29.03 37.98,27.81 LEVEL_SHIFTER.J2.5 | v57.15,46.9 57.24,46.99 UART.TX
  Bottom 0.254: ARDUINO_NANO1.TX1 43.31,46.99 57.05,46.99 v57.15,46.9
VCC  (via drill 0.35)
  Top 0.813: 0.64,10.74 0.64,28.52 1.91,29.79 CON_I2C_2.VC 3.17,31.37 6.35,34.54 v6.35,47.62 | J1.P1 65.28,0.64 | POWER_CONNECTOR_2.VCC 74.24,0.64 65.28,0.64 | 65.28,0.64 0.64,0.64 0.64,10.74 | 0.64,10.74 POWER_CONNECTOR_1.VCC
  Bottom 0.813: J1.P1 62.87,6.1 62.87,12.7 64.39,14.22 66.62,14.22 CON_AUX.VC 73.66,14.28 CON_I2C_1.VC | v6.35,47.62 15.24,56.52 U$5.1
VCC_IMU_AUX
  Top 0.254: U$4.2 31.11,46.23 U1.VCC_AUX
VSERVO
  Top 0.813: S6.VCC S5.VCC S4.VCC 67.31,64.77 68.58,66.04 72.39,66.04 76.2,62.23 SERVO3.VCC | U$5.2 19.68,59.05 16.51,62.23 SERVO1.VCC
  Bottom 0.813: S6.VCC 67.31,56.52 65.91,55.12 61.72,55.12 60.56,56.28 30.48,56.28 | U$5.2 25.15,59.05 27.93,56.28 30.48,56.28 | SERVO2.VCC 30.48,56.28

### Text on the board
tPlace: SONAR2 | SERVO2 | ANALOG2 | IR SENSOR BAR | ANALOG3 | ANALOG1 | 10K | 10K | 10K | SERVOS | 5V | SERVO1 | SERVO3 | VSERVO | VCC | SONAR1 | SONAR3 | UART | IMU / AUX | 3V3 | 5V | BLUETOOTH / UART 3V3 | I2C_2 | I2C_1 | 4K7 | I2C PULLUP | I2C 3V3 | I2C CONNECTOR | I2C CONNECTOR | GND | EXPANSION CONNECTOR | BAT / SENSE | ARD | ARD | ARDUINO NANO | POWER SELECTOR | 3V3 | 5V | VBAT | REG | REG | POWER CONNECTOR | MOTOR CONNECTOR | POWER CONNECTOR | VBAT | AUX POWER
bPlace: v1.0 | Arduino Nano Module | OPEN ROBOT V2.0 | www.luisllamas.es